# EasyEDA schematic Estacion meteo.json
TITLE: Sheet_1; REV: 1.0; Date: 2023-03-19; Sheet: 1/1; Drawn By: ruiz17alberto; Company: Your Company
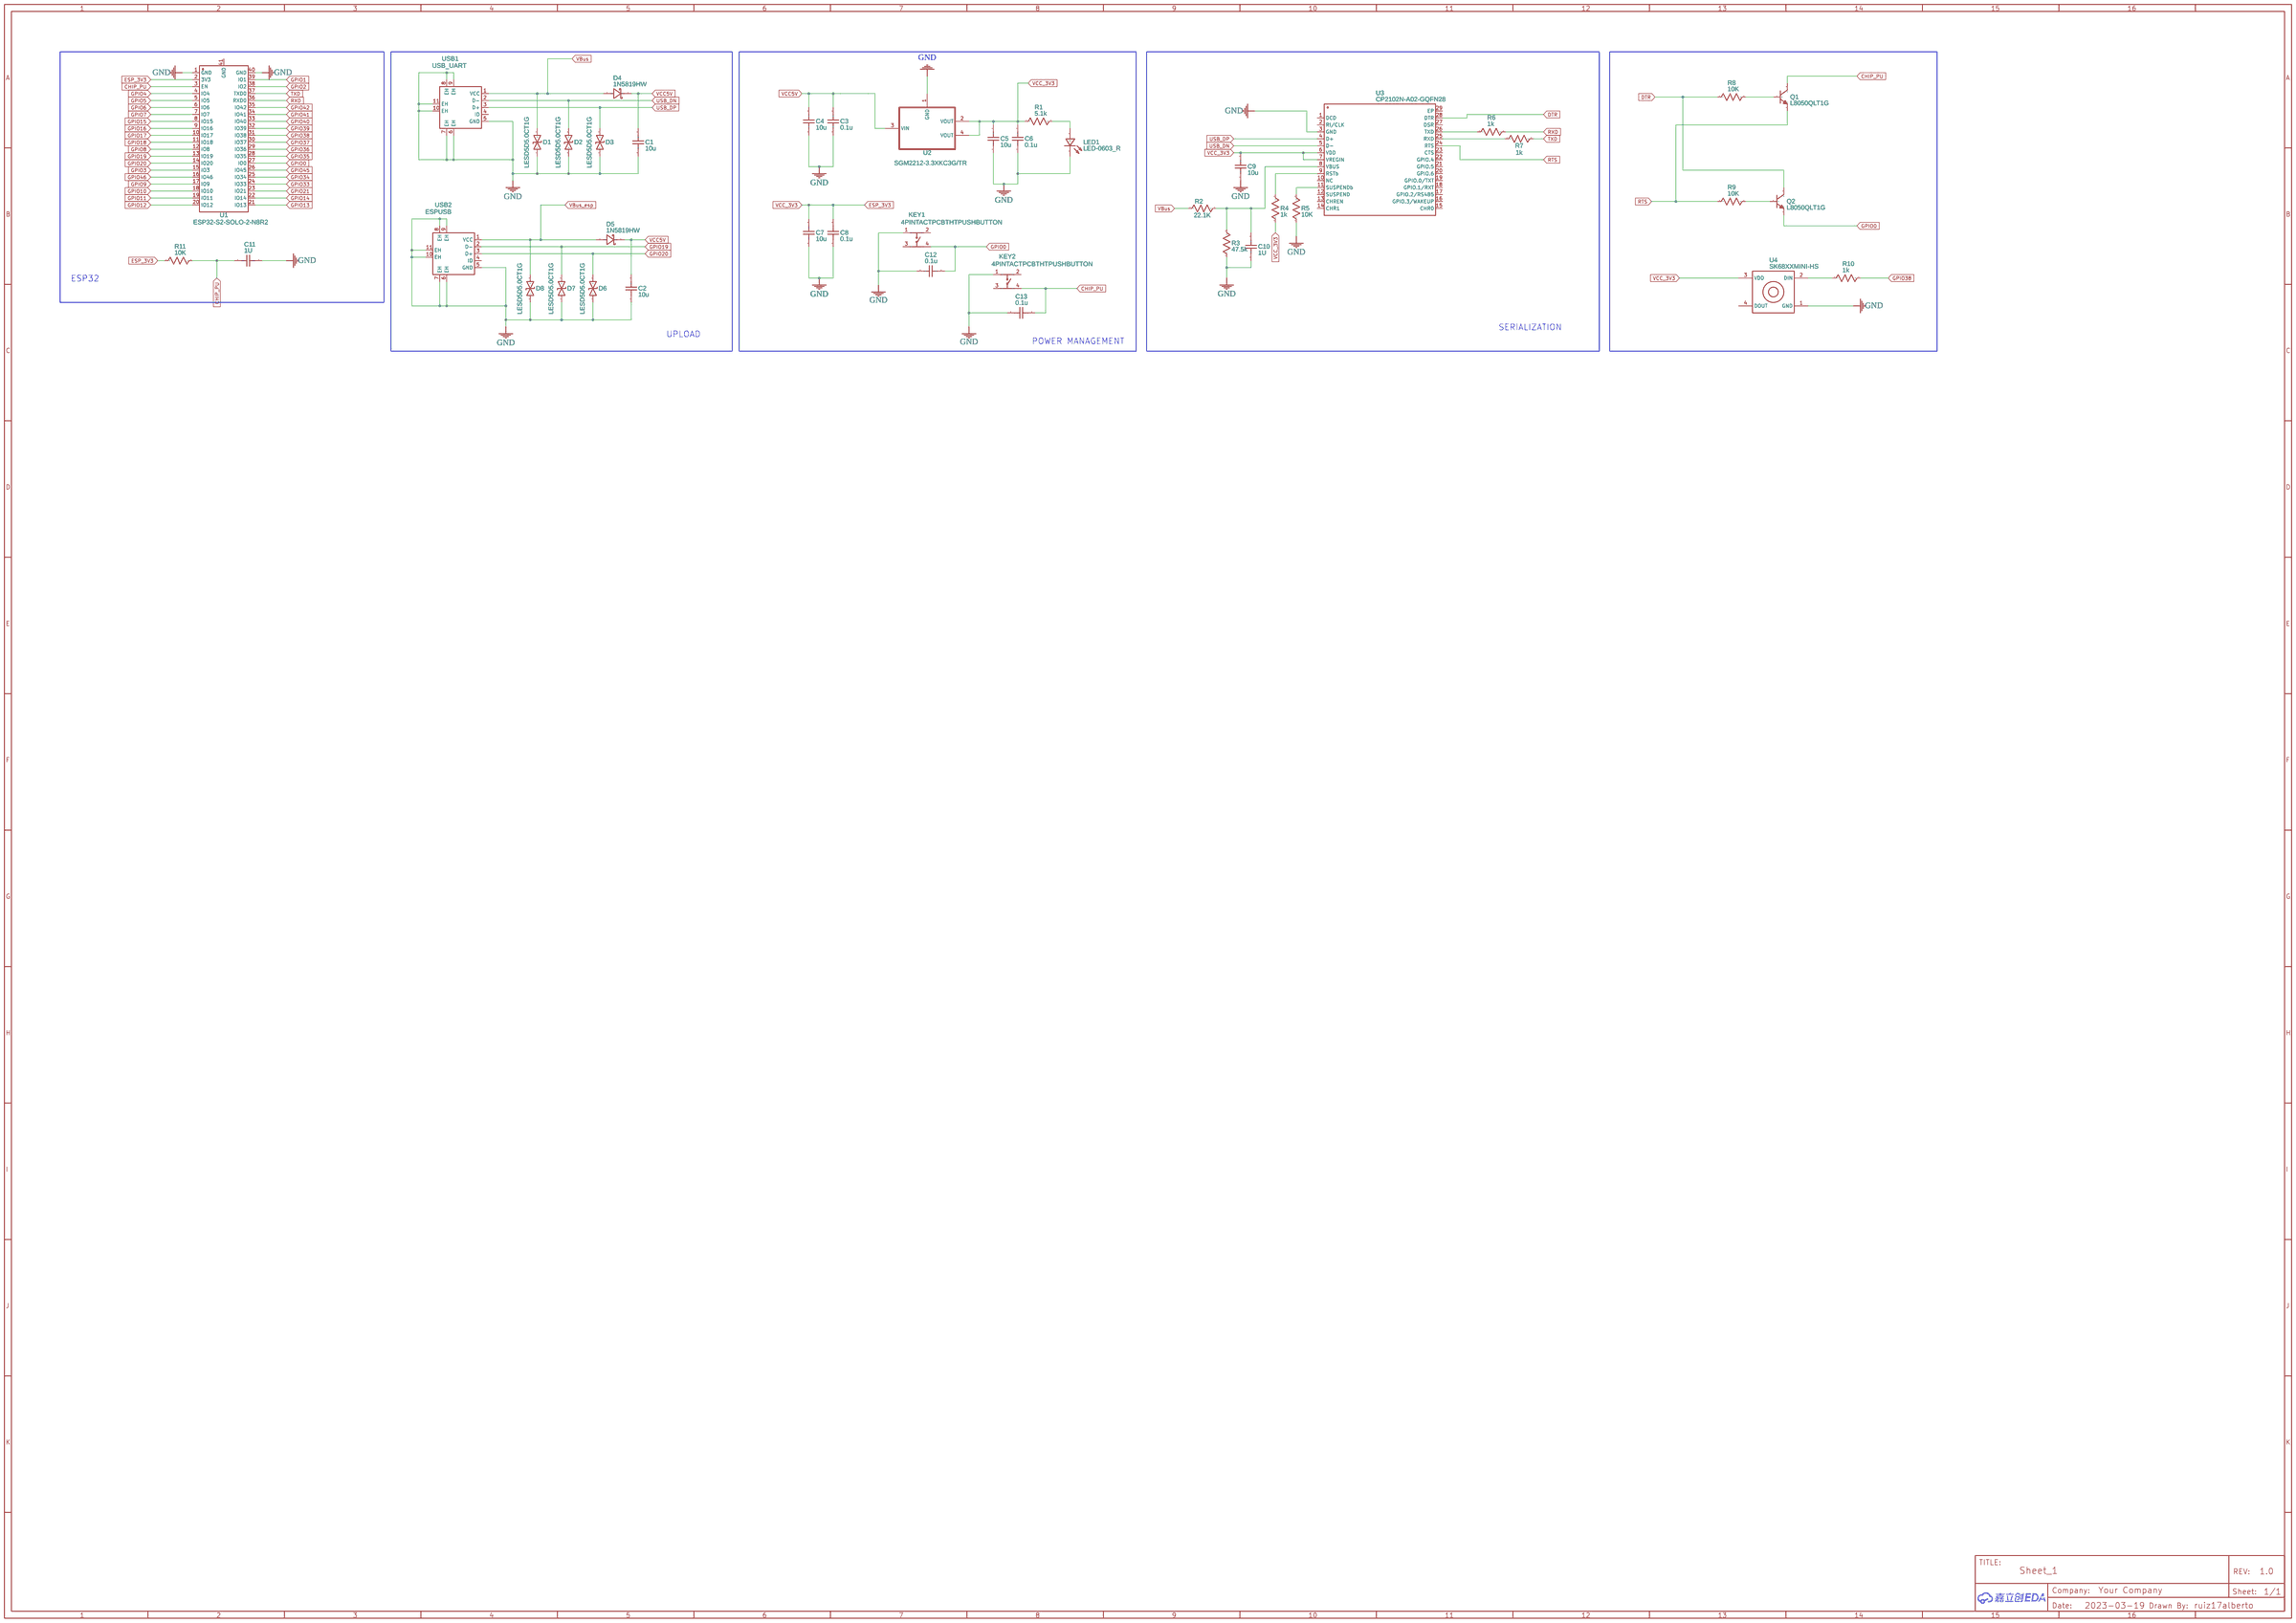
[diagram p0: schematic sheet]

## Parts
C1  10u  [C0603]
C2  10u  [C0603]
C3  0.1u  [C0603]
C4  10u  [C0603]
C5  10u  [C0603]
C6  0.1u  [C0603]
C7  10u  [C0603]
C8  0.1u  [C0603]
C9  10u  [C0603]
C10  1U  [C0603]
C11  1U  [C0603]
C12  0.1u  [C0603]
C13  0.1u  [C0603]
D1  LESD5D5.0CT1G  [SOD-523_L1.2-W0.8-LS1.6-BI]
D2  LESD5D5.0CT1G  [SOD-523_L1.2-W0.8-LS1.6-BI]
D3  LESD5D5.0CT1G  [SOD-523_L1.2-W0.8-LS1.6-BI]
D4  1N5819HW  [SOD-123_L2.7-W1.6-LS3.7-RD-1]
D5  1N5819HW  [SOD-123_L2.7-W1.6-LS3.7-RD-1]
D6  LESD5D5.0CT1G  [SOD-523_L1.2-W0.8-LS1.6-BI]
D7  LESD5D5.0CT1G  [SOD-523_L1.2-W0.8-LS1.6-BI]
D8  LESD5D5.0CT1G  [SOD-523_L1.2-W0.8-LS1.6-BI]
KEY1  4PINTACTPCBTHTPUSHBUTTON  [SW-SMD_4P-L6.0-W6.0-P4.50-LS10.0_TL3301EF160QG]
KEY2  4PINTACTPCBTHTPUSHBUTTON  [SW-SMD_4P-L6.0-W6.0-P4.50-LS10.0_TL3301EF160QG]
LED1  LED-0603_R  [LED0603_RED]
Q1  L8050QLT1G  [SOT-23-3_L2.9-W1.3-P1.90-LS2.4-BR]
Q2  L8050QLT1G  [SOT-23-3_L2.9-W1.3-P1.90-LS2.4-BR]
R1  5.1k  [R0603]
R2  22.1K  [R0603]
R3  47.5k  [R0603]
R4  1k  [R0603]
R5  10K  [R0603]
R6  1k  [R0603]
R7  1k  [R0603]
R8  10K  [R0603]
R9  10K  [R0603]
R10  1k  [R0603]
R11  10K  [R0603]
U1  ESP32-S2-SOLO-2-N8R2  [WIRELM-SMD_ESP32-S3-WROOM-1]
U2  SGM2212-3.3XKC3G/TR  [SOT-223-4_L6.5-W3.5-P2.30-LS7.0-BR]
U3  CP2102N-A02-GQFN28  [QFN-28_L5.0-W5.0-P0.50-TL-EP3.3]
U4  SK68XXMINI-HS
USB1  USB_UART  [MICRO-USB_MICRO-USB-5S]
USB2  ESPUSB  [MICRO-USB_MICRO-USB-5S]

## Library data of the parts
C1-C13 = C_0603_US: Contributor: LCEDA_Lib
D1-D3 D6-D8 = LESD5D5.0CT1G: Contributor: LCSC; Supplier: LCSC; Supplier Part: C383211; Manufacturer: LRC(乐山无线电); JLCPCB Part Class: Extended Part
D4 D5 = 1N5819HW: Contributor: LCSC; Supplier: LCSC; Supplier Part: C2905649; Manufacturer: TECH PUBLIC(台舟); JLCPCB Part Class: Extended Part
KEY1 KEY2 = 4PINTACTPCBTHTPUSHBUTTON: Contributor: LCSC; Supplier: LCSC; Supplier Part: C9900003768; Manufacturer: null; JLCPCB Part Class: Extended Part
LED1 = LED-0603_R: Manufacturer: EVERLIGHT(台湾亿光); Manufacturer Part: 19-217/R6C-AL1M2VY/3T; Supplier Part: C72044; Supplier: LCSC; Contributor: LCEDA_01
Q1 Q2 = L8050QLT1G: Supplier: LCSC; Manufacturer: LRC(乐山无线电); Supplier Part: C49581; JLCPCB Part Class: Extended Part
R1-R11 = R_0603_US: Contributor: LCEDA_Lib
U1 = ESP32-S2-SOLO-2-N8R2: Supplier: LCSC; Supplier Part: C9900065648; Manufacturer: null; Contributor: lcsc
U2 = SGM2212-3.3XKC3G/TR: Contributor: lcsc; Supplier: LCSC; Supplier Part: C9900018517; Manufacturer: null; JLCPCB Part Class: Extended Part
U3 = CP2102N-A02-GQFN28: Contributor: LCSC; Supplier: LCSC; Supplier Part: C1550553; Manufacturer: SKYWORKS/SILICON LABS(芯科); JLCPCB Part Class: Extended Part
U4 = SK68XXMINI-HS: Manufacturer: Rose Lighting Technologies; Supplier: Digi-Key; Supplier Part: 1528-1541-ND; link: https://www.rose-lighting.com/wp-content/uploads/sites/53/2020/05/SK68XX-MINI-HS-REV.04-EN23535RGB-thick.pdf; Contributor: ismailvawda
USB1 USB2 = MICROUSB5S: Contributor: lcsc; Supplier: LCSC; Supplier Part: C9900018063; Manufacturer: null; JLCPCB Part Class: Extended Part

## Nets
GND: C1.1 C2.1 C3.1 C4.1 C5.1 C6.1 C7.1 C8.1 C9.1 C10.1 C11.2 C12.2 C13.2 D1.1 D2.1 D3.1 D6.1 D7.1 D8.1 KEY1.1 KEY2.1 LED1.2 R3.1 R5.1 U1.1(GND) U1.40(GND) U2.1(GND) U3.3(GND) U4.1(GND) USB1.5(GND) USB1.6(EH) USB1.7(EH) USB1.8(EH) USB1.9(EH) USB1.10(EH) USB1.11(EH) USB2.5(GND) USB2.6(EH) USB2.7(EH) USB2.8(EH) USB2.9(EH) USB2.10(EH) USB2.11(EH)
VBus: D1.2 D4.2(A) R2.1 USB1.1(VCC)
VBus_esp: D5.2(A) D8.2 USB2.1(VCC)
VCC5V: C1.2 C2.2 C3.2 C4.2 D4.1(K) D5.1(K) U2.3(VIN)
CHIP_PU: C11.1 C13.1 KEY2.4 Q1.3(C) R11.2 U1.3(EN)
DTR: Q2.3(C) R8.1 U3.28(DTR)
ESP_3V3: C5.2 C6.2 C7.2 C8.2 C9.2 R1.1 R4.1 R11.1 U1.2(3V3) U2.2(VOUT) U2.4(VOUT) U3.6(VDD) U3.7(VREGIN) U4.3(VDD)
GPIO0: C12.1 KEY1.4 Q2.2(E) U1.27(IO0)
GPIO1: U1.39(IO1)
GPIO2: U1.38(IO2)
GPIO3: U1.15(IO3)
GPIO4: U1.4(IO4)
GPIO5: U1.5(IO5)
GPIO6: U1.6(IO6)
GPIO7: U1.7(IO7)
GPIO8: U1.12(IO8)
GPIO9: U1.17(IO9)
GPIO10: U1.18(IO10)
GPIO11: U1.19(IO11)
GPIO12: U1.20(IO12)
GPIO13: U1.21(IO13)
GPIO14: U1.22(IO14)
GPIO15: U1.8(IO15)
GPIO16: U1.9(IO16)
GPIO17: U1.10(IO17)
GPIO18: U1.11(IO18)
GPIO19: D7.2 U1.13(IO19) USB2.2(D-)
GPIO20: D6.2 U1.14(IO20) USB2.3(D+)
GPIO21: U1.23(IO21)
GPIO33: U1.24(IO33)
GPIO34: U1.25(IO34)
GPIO35: U1.28(IO35)
GPIO36: U1.29(IO36)
GPIO37: U1.30(IO37)
GPIO38: R10.2 U1.31(IO38)
GPIO39: U1.32(IO39)
GPIO40: U1.33(IO40)
GPIO41: U1.34(IO41)
GPIO42: U1.35(IO42)
GPIO45: U1.26(IO45)
GPIO46: U1.16(IO46)
RTS: Q1.2(E) R9.1 U3.24(RTS)
RXD: R6.2 U1.36(RXD0)
TXD: R7.2 U1.37(TXD0)
USB_DN: D2.2 U3.5(D-) USB1.2(D-)
USB_DP: D3.2 U3.4(D+) USB1.3(D+)
Net-(C10-2): C10.2 R2.2 R3.2 U3.8(VBUS)
Net-(LED1-1): LED1.1 R1.2
Net-(Q1-1): Q1.1(B) R8.2
Net-(Q2-1): Q2.1(B) R9.2
Net-(R4-2): R4.2 U3.9(RSTb)
Net-(R5-2): R5.2 U3.11(SUSPENDb)
Net-(R6-1): R6.1 U3.26(TXD)
Net-(R7-1): R7.1 U3.25(RXD)
Net-(R10-1): R10.1 U4.2(DIN)

Not connected (* = marked no-connect by the designer): KEY1 2 3; KEY2 2 3; U1 41(GND); U3 1(DCD) 2(RI/CLK) 10(NC) 12(SUSPEND) 13(CHREN) 14(CHR1) 15(CHR0) 16(GPIO.3/WAKEUP) 17(GPIO.2/RS485) 18(GPIO.1/RXT) 19(GPIO.0/TXT) 20(GPIO.6) 21(GPIO.5) 22(GPIO.4) 23(CTS) 27(DSR) 29(EP); U4 4(DOUT); USB1 4(ID); USB2 4(ID)

## Notes on the sheet
- ESP32
- SERIALIZATION
- UPLOAD
- POWER MANAGEMENT
